# EAGLE design R4Nano (EAGLE 7.6.0)
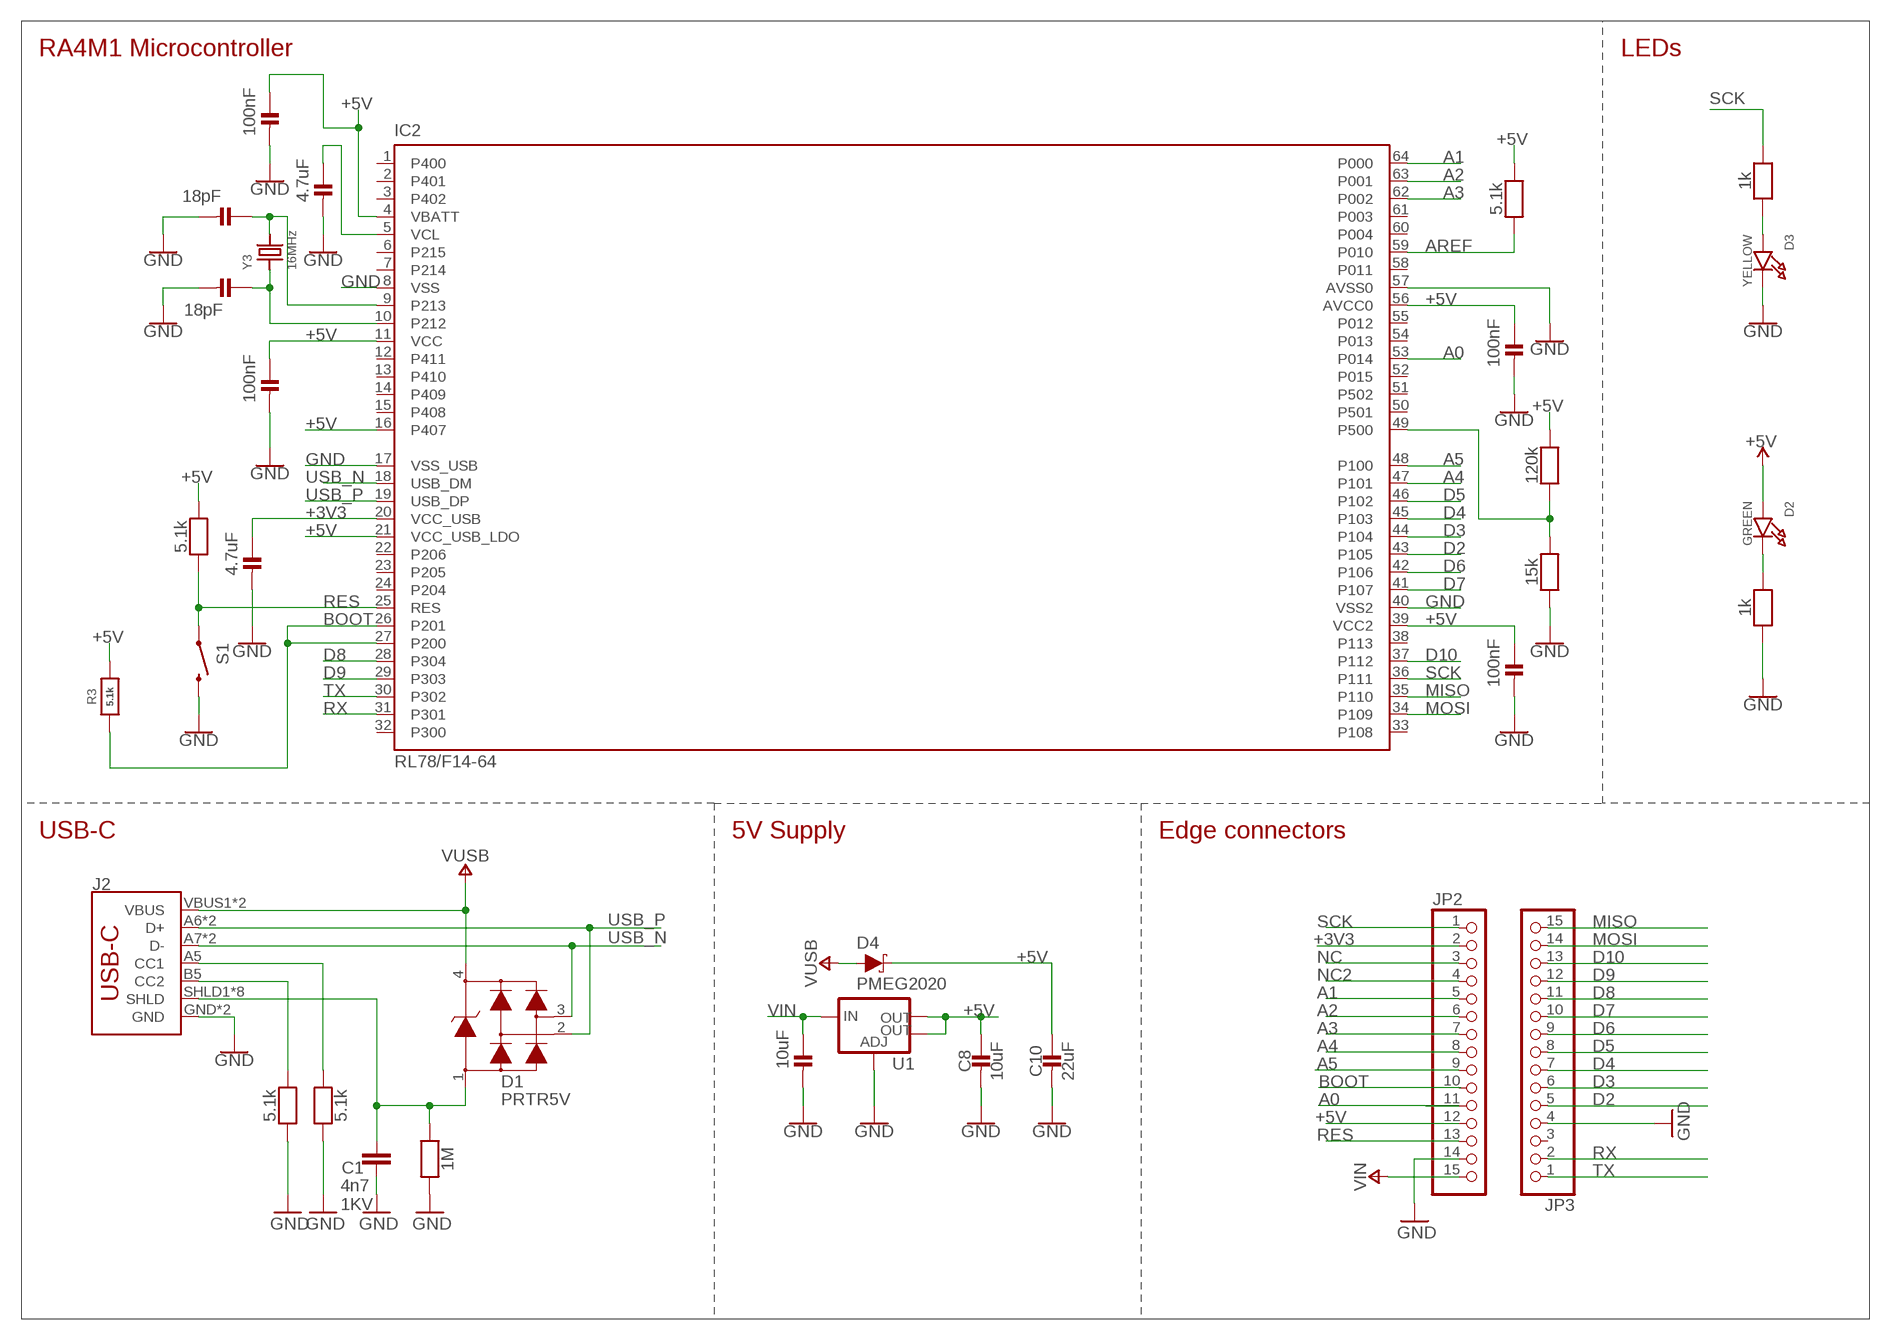
[diagram p0: schematic, sheet 1]

## Parts
C1  4n7  C4.7NF-0805  [0805-R2013X50N]
C2  4.7uF  CAP_CERAMIC_0805MP  [_0805MP]
C3  100nF  CAP_CERAMIC_0805MP  [_0805MP]
C4  100nF  CAP_CERAMIC_0805MP  [_0805MP]
C5  4.7uF  CAP_CERAMIC_0805MP  [_0805MP]
C6  100nF  CAP_CERAMIC_0805MP  [_0805MP]
C7  10uF  CAP_CERAMIC_0805MP  [_0805MP]
C8  10uF  CAP_CERAMIC_0805MP  [_0805MP]
C9  100nF  CAP_CERAMIC_0805MP  [_0805MP]
C10  22uF  CAP_CERAMIC_0805MP  [_0805MP]
C12  18pF  CAP_CERAMIC_0805MP  [_0805MP]
C13  18pF  CAP_CERAMIC_0805MP  [_0805MP]
D1  PRTR5V  PRTR5V0U2X,215  [SOT190P230X110-4N]
D2  GREEN  LED0805_NOOUTLINE  [CHIPLED_0805_NOOUTLINE]
D3  YELLOW  LED0805_NOOUTLINE  [CHIPLED_0805_NOOUTLINE]
D4  PMEG2020  DIODE-SCHOTTKY-BAT60A  [SOD-323]
IC2  RL78/F14-64  [P-LFQFP64-10X10]
J2  USB_C2-LAYER  [USB-C-16P]
JP2  HEADER-1X15  [1X15_ROUND_70]
JP3  HEADER-1X15  [1X15_ROUND_70]
R1  1M  RESISTOR_0805MP  [_0805MP]
R2  5.1k  RESISTOR_0805MP  [_0805MP]
R3  5.1k  RESISTOR_0805MP  [_0805MP]
R4  5.1k  RESISTOR_0805MP  [_0805MP]
R5  1k  RESISTOR_0805MP  [_0805MP]
R6  5.1k  RESISTOR_0805MP  [_0805MP]
R8  5.1k  RESISTOR_0805MP  [_0805MP]
R10  120k  RESISTOR_0805MP  [_0805MP]
R11  15k  RESISTOR_0805MP  [_0805MP]
R12  1k  RESISTOR_0805MP  [_0805MP]
S1  SWITCH-MOMENTARY-2SMD-4.6X2.8MM  [TACTILE_SWITCH_SMD_4.6X2.8MM]
U1  V_REG_LM1117SOT223  [SOT223]
Y3  16MHz  CRYSTAL2.5X2.0MM  [CRYSTAL_2.5X2]

## Nets
+3V3: C5.1 IC2.20(VCC_USB) JP2.2
+5V: C3.1 C4.1 C6.1 C8.1 C9.1 C10.1 D2.A D4.C IC2.4(VBATT) IC2.11(VCC) IC2.16(P407) IC2.21(VCC_USB_LDO) IC2.39(VCC2) IC2.56(AVCC0) JP2.12 R2.1 R3.1 R4.1 R10.1 U1.2(OUT) U1.4(OUT) ; supply symbol labelled VOUT
A0: IC2.53(P014) JP2.11
A1: IC2.64(P000) JP2.5
A2: IC2.63(P001) JP2.6
A3: IC2.62(P002) JP2.7
A4: IC2.47(P101) JP2.8
A5: IC2.48(P100) JP2.9
AREF: IC2.59(P010) R2.2
BOOT: IC2.26(P201) IC2.27(P200) JP2.10 R3.2
CC1: J2.A5(CC1) R8.1
CC2: J2.B5(CC2) R6.1
D2: IC2.43(P105) JP3.5
D3: IC2.44(P104) JP3.6
D4: IC2.45(P103) JP3.7
D5: IC2.46(P102) JP3.8
D6: IC2.42(P106) JP3.9
D7: IC2.41(P107) JP3.10
D8: IC2.28(P304) JP3.11
D9: IC2.29(P303) JP3.12
D10: IC2.37(P112) JP3.13
GND: C1.2 C2.2 C3.2 C4.2 C5.2 C6.2 C7.2 C8.2 C9.2 C10.2 C12.2 C13.2 D3.C IC2.8(VSS) IC2.17(VSS_USB) IC2.40(VSS2) IC2.57(AVSS0) J2.GND J2.GND2(GND) JP2.14 JP3.4 R1.2 R5.1 R6.2 R8.2 R11.2 S1.3 S1.4 U1.1(ADJ)
MISO: IC2.35(P110) JP3.15
MOSI: IC2.34(P109) JP3.14
N$1: C12.1 IC2.9(P213) Y3.3
N$2: C13.1 IC2.10(P212) Y3.1
N$3: C2.1 IC2.5(VCL)
N$4: D2.C R5.2
N$5: D3.A R12.2
N$9: IC2.49(P500) R10.2 R11.1
NC: JP2.3
NC2: JP2.4
RES: IC2.25(RES) JP2.13 R4.2 S1.1 S1.2
RX: IC2.31(P301) JP3.2
SCK: IC2.36(P111) JP2.1 R12.1
SHIELD: C1.1 D1.1 J2.SHLD1(SHLD) J2.SHLD2(SHLD) J2.SHLD3(SHLD) J2.SHLD4(SHLD) J2.SHLD5(SHLD) J2.SHLD6(SHLD) J2.SHLD7(SHLD) J2.SHLD8(SHLD) R1.1
TX: IC2.30(P302) JP3.1
USB_N [usb]: D1.3 IC2.18(USB_DM) J2.A7(D-) J2.B7(D-)
USB_P [usb]: D1.2 IC2.19(USB_DP) J2.A6(D+) J2.B6(D+)
VIN: C7.1 JP2.15 U1.3(IN)
VUSB: D1.4 D4.A J2.VBUS1(VBUS) J2.VBUS2(VBUS)
Unconnected: IC2.1(P400) IC2.2(P401) IC2.3(P402) IC2.6(P215) IC2.7(P214) IC2.12(P411) IC2.13(P410) IC2.14(P409) IC2.15(P408) IC2.22(P206) IC2.23(P205) IC2.24(P204) IC2.32(P300) IC2.33(P108) IC2.38(P113) IC2.50(P501) IC2.51(P502) IC2.52(P015) IC2.54(P013) IC2.55(P012) IC2.58(P011) IC2.60(P004) IC2.61(P003) JP3.3

## Notes on the sheet
- RA4M1 Microcontroller | LEDs
- USB-C | 5V Supply | Edge connectors

## Library data of the parts
C1 = Arduino-rcl:C: SMD Capacitor; CODE-ARDUINO: 0689; DATASHEET: http://www.kemet.com/Lists/ProductCatalog/Attachments/40/KEM_C1010_X7R_HV_SMD.pdf; DISTRIBUTOR-LINK: www.kemet.com/docfinder?Partnumber=C0805C472KDRACTU; DISTRIBUTOR-PN: 399-6738-1-ND; MANUFACTURER: Kemet; MANUFACTURER-PN: C0805C472KDRACTU; NOTE: -; VOLTAGE: 1KV
C2-C10 C12 C13 = microbuilder:CAP_CERAMIC: Ceramic Capacitors For new designs, use the packages preceded by an '_' character since they are more reliable: The following footprints should be used on most boards: _0402 - Standard footprint for regular board layouts _0603 - Standard footprint for regular board layouts _0805 - Standard footprint for regular board layouts _1206 - Standard footprint for regular board layouts For extremely tight-pitch boards where space is at a premium, the following 'micro-pitch' footprints can be used (smaller pads, no silkscreen outline, etc.): _0402MP - Micro-pitch footprint for very dense/compact boards _0603MP - Micro-pitch footprint for very dense/compact boards _0805MP - Micro-pitch footprint for very dense/compact boards _1206MP - Micro-pitch footprint for very dense/compact boards
D1 = Arduino-diodes:PRTR5V0U2X,215: USB ESD protection; CODE-ARDUINO: 2209; DATASHEET: http://www.nxp.com/documents/data_sheet/PRTR5V0U2X.pdf; DISTRIBUTOR-LINK: http://www.digikey.com/product-detail/en/nxp-semiconductors/PRTR5V0U2X,215/568-4140-1-ND/1589981; DISTRIBUTOR-PN: 568-4140-1-ND; MANUFACTURER: NXP; MANUFACTURER-PN: PRTR5V0U2X,215
D2 D3 = microbuilder:LED: LED 0603 - 0603 Surface Mount Package 2mA: Green LED - Low Power (3.9mcd, 2ma, 1.7Vf) - Digikey: 475-2709-2-ND Orange LED - Low Power (9.8mcd, 2ma, 1.8Vf) - Digikey: 475-1194-2-ND Red LED - Low Power (5mcd, 2ma, 1.8Vf) - Digikey: 475-1195-2-ND Yellow LED - Low Power (7mcd, 2ma, 1.8Vf) - Digikey: 475-1196-2-ND 5mA: Blue LED - Low Power (17mcd, 5ma, 2.9Vf) - Digikey: LNJ937W8CRACT-ND 0805 - 0805 Surface Mount Package 2mA: Red LED (8.8mcd, 2mA, 1.8Vf, Clear) - Low Power [Digikey: 475-2510-1-ND] Green LED (5mcd, 2mA, 1.8Vf, Clear) - Low Power [Digikey: 475-2730-1-ND] Yellow LED (11.3mcd, 2mA, 1.8Vf, Clear) - Low Power [Digikey: 475-2555-1-ND] 20mA: Red LED (104mcd, 20mA, Diffused) - LS R976 [Digikey: 475-1278-6-ND] Red LED (12mcd, 20mA, 2.0Vf, Clear) - APT2012EC [Digikey: 754-1128-1-ND] Green LED (15mcd, 20mA, 2.2Vf, Clear) - APT2012GC [Digikey: 754-1131-1-ND] Orange LED (160mcd, 20mA, 2.1Vf, Clear) - APT2012SECK [Digikey: 754-1130-1-ND] 1206 - 1206 Surface Mount Package Green LED (26mcd, 20mA, Diffused) - LG N971 [Digikey: 475-1407-6-ND] Red LED (15mcd, 20mA, Diffused) - LH N974 [Digikey: 475-1416-6-ND]
D4 = SparkFun-DiscreteSemi:DIODE-SCHOTTKY: Schottky diode A Schottky diode is a semiconductor diode which has a low forward voltage drop and a very fast switching action.; PROD_ID: DIO-14072; VALUE: 3A/10V/280mV
IC2 = technoblogy:RL78/F14-64: 16-Bit Single-Chip Microcontroller Source: Data sheet <http://documentation.renesas.com/doc/products/mpumcu/doc/rl78/r01uh0368ej0200_rl78f13_14.pdf>
J2 = SparkFun-Connectors:USB_C: USB Type C 16Pin Connector Super Speed pins not available on the 16-pin purely SMD connector so this part is best for USB 2.0 implementations. D1 and D2 are tied together enabling D+/- no matter which way the cable is plugged into the connector. The two channel configuration pins (CC1/2) are exposed. These are normally connected to ground via 5.1k resistors but can be reconfigured for high current/high power applications.; PROD_ID: CONN-14122
JP2 JP3 = microbuilder:HEADER-1X15: 1x15 Header
R1-R6 R8 R10-R12 = microbuilder:RESISTOR: Resistors For new designs, use the packages preceded by an '_' character since they are more reliable: The following footprints should be used on most boards: _0402 - Standard footprint for regular board layouts _0603 - Standard footprint for regular board layouts _0805 - Standard footprint for regular board layouts _1206 - Standard footprint for regular board layouts For extremely tight-pitch boards where space is at a premium, the following 'micro-pitch' footprints can be used (smaller pads, no silkscreen outline, etc.): _0402MP - Micro-pitch footprint for very dense/compact boards _0603MP - Micro-pitch footprint for very dense/compact boards _0805MP - Micro-pitch footprint for very dense/compact boards _1206MP - Micro-pitch footprint for very dense/compact boards
S1 = SparkFun-Electromechanical:SWITCH-MOMENTARY-2: Various NO switches- pushbuttons, reed, etc; PROD_ID: SWCH-13065
U1 = SparkFun-PowerIC:V_REG_LM1117: Voltage Regulator LM1117 Standard adjustable voltage regulator but in SMD form. Spark Fun Electronics SKU : COM-00595; PROD_ID: VREG-08170
Y3 = microbuilder:CRYSTAL: Crystals HC49UP - Surface Mount Crystal 4.0MHz 18pF +/-30ppm Surface Mount Crystal [Digikey: 535-9857-1-ND] 12.0 MHz Surface Mount Crystal [Digikey: 535-9869-6-ND] 25.0 MHz Surface Mount Crystal [Digikey: 535-9078-1-ND] 2.5 x 2.0mm - MEMs SMT Crystal 16.0 MHz 10pF 20ppm 2.5 x 2.0mm Crystal [Digikey -40-85°C: 535-10923-1-ND] 3.2 x 2.5mm - MEMs SMT Crystal 12.0 MHz 8pF 15ppm 3.2 x 2.5mm Crystal [Digikey: -10-70°C: 644-1047-1-ND -40-125°C: 644-1128-1-ND] 16.0 MHz 8pF 15ppm 3.2 x 2.5mm Crystal [Digikey: -10-70°C: 644-1049-1-ND -40-125°C: 644-1129-2-ND] 16.0 MHz 10pF 10ppm 3.2 x 2.5mm Crystal [Digikey: 644-1100-1-ND] 27.12 MHz 18pF 30ppm 3.2 x 2.5mm Crystal [Digikey: 887-1424-1-ND] 27.12MHz 10pF 10ppm 3.2 x 2.5mm Crystal [Digikey: 887-1329-1-ND] 4.9 x 1.8mm - MEMs SMT Crystal 32.768 KHz 12.5pF 20ppm 4.9 x 1.8mm Crystal [Digikey: SE2415CT-ND] 8.0 x 3.8mm - Surface Mount Crystal 32.768kHz 12.5pF 20ppm -40°C-85°C [Digikey: 535-9166-2-ND] Cylinder 32.768KHz Cylinder Crystal (2x6mm body) [Ex. Digikey: 300-8341-2-ND]

## Net classes
0 default: width 0.152 mm, drill 0.305 mm, clearance 0.152 mm
1 usb: width 0.19 mm, drill 0.19 mm

## Board
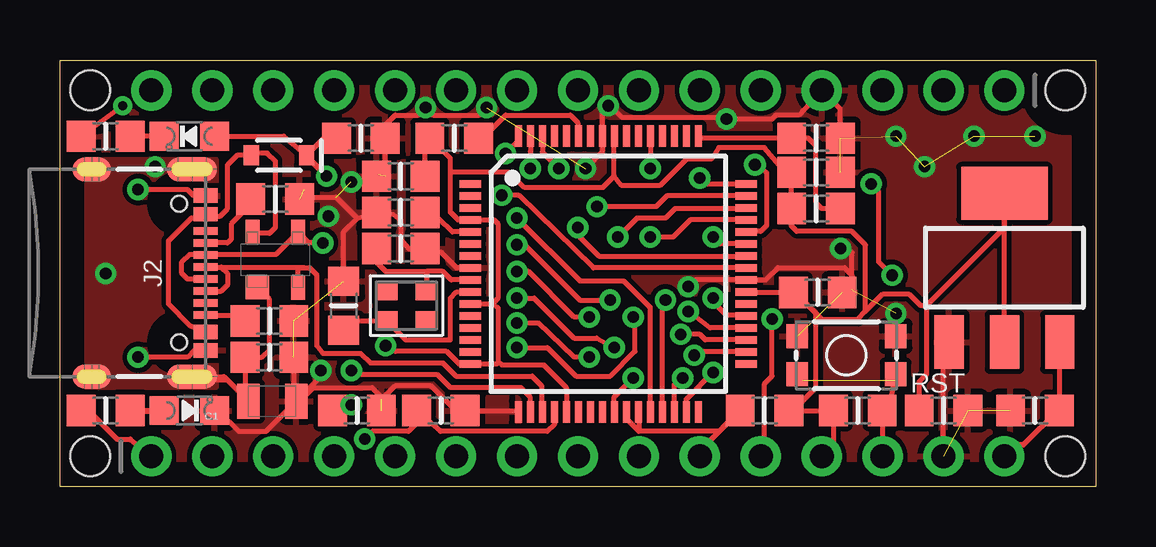
[diagram p1: board, top side]
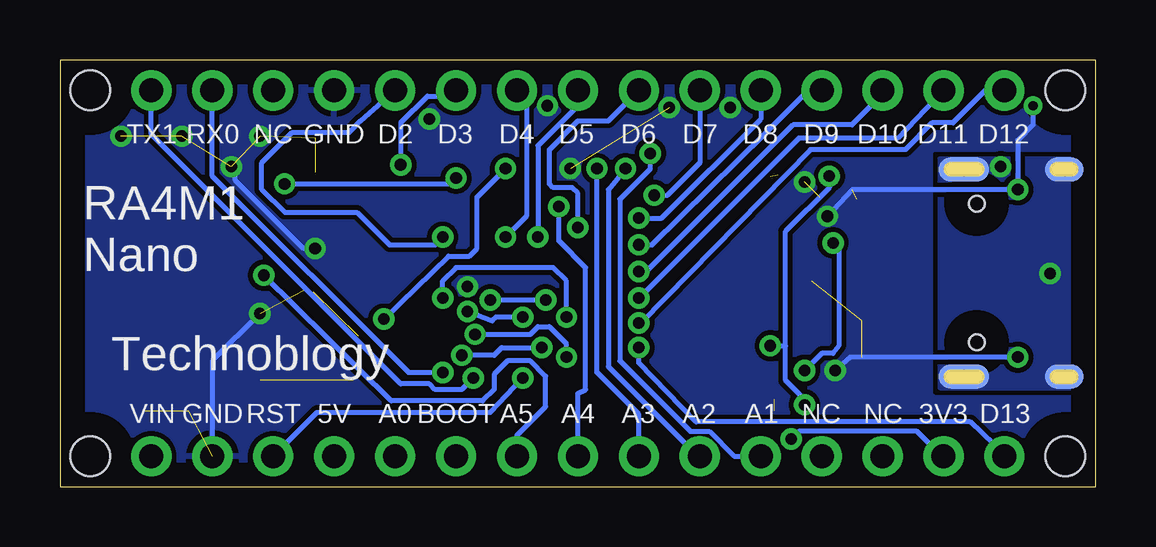
[diagram p2: board, bottom side, seen from below]

Size 43.18 x 17.78 mm. Coordinates in mm from the lower left corner, seen from the top.
Outline: 0,0 0,17.78 43.18,17.78 43.18,0 0,0
Copper layers (1*16): Top 0.035mm / dielectric 1.5mm / Bottom 0.035mm
Design rules "SeeedStudio_4layers *": minimum track width 8mil, minimum drill 19mil, track to track 8mil, track to pad 8mil, pad to pad 8mil, via to via 8mil, smd to smd 0mil, copper to edge 40mil, drill to drill 8mil, minimum pad ring 6mil, minimum via ring 8mil, stop-mask expansion 4mil, vias tented up to drill 20mil, thermal gap 10mil
Holes 1.65 mm at 1.27,16.51 1.27,1.27 41.91,1.27 41.91,16.51

### Footprints (pad centres in the part's own frame; a part is rotated, then mirrored left to right if it is on the bottom)
0805-R2013X50N = smd 0.95 x 1.45: 1 -1,0; 2 1,0
_0805MP = smd 1.2 x 1.3: 1 -1.016,0; 2 1.016,0
SOT190P230X110-4N = smd 1 x 1: 1 -1.15,0.75 | smd 1 x 0.6: 2 -1.15,-0.95; 3 1.15,-0.95; 4 1.15,0.95
CHIPLED_0805_NOOUTLINE = smd 1.2 x 1.2: A 0,-1.05; C 0,1.05
SOD-323 = smd 0.63 x 0.83: A 1.15,0; C -1.15,0
P-LFQFP64-10X10 = smd 0.9 x 0.3: 1 -5.75,3.75; 2 -5.75,3.25; 3 -5.75,2.75; 4 -5.75,2.25; 5 -5.75,1.75; 6 -5.75,1.25; 7 -5.75,0.75; 8 -5.75,0.25; 9 -5.75,-0.25; 10 -5.75,-0.75; 11 -5.75,-1.25; 12 -5.75,-1.75; 13 -5.75,-2.25; 14 -5.75,-2.75; 15 -5.75,-3.25; 16 -5.75,-3.75; 33 5.75,-3.75; 34 5.75,-3.25; 35 5.75,-2.75; 36 5.75,-2.25; 37 5.75,-1.75; 38 5.75,-1.25; 39 5.75,-0.75; 40 5.75,-0.25; 41 5.75,0.25; 42 5.75,0.75; 43 5.75,1.25; 44 5.75,1.75; 45 5.75,2.25; 46 5.75,2.75; 47 5.75,3.25; 48 5.75,3.75 | smd 0.3 x 0.9: 17 -3.75,-5.75; 18 -3.25,-5.75; 19 -2.75,-5.75; 20 -2.25,-5.75; 21 -1.75,-5.75; 22 -1.25,-5.75; 23 -0.75,-5.75; 24 -0.25,-5.75; 25 0.25,-5.75; 26 0.75,-5.75; 27 1.25,-5.75; 28 1.75,-5.75; 29 2.25,-5.75; 30 2.75,-5.75; 31 3.25,-5.75; 32 3.75,-5.75; 49 3.75,5.75; 50 3.25,5.75; 51 2.75,5.75; 52 2.25,5.75; 53 1.75,5.75; 54 1.25,5.75; 55 0.75,5.75; 56 0.25,5.75; 57 -0.25,5.75; 58 -0.75,5.75; 59 -1.25,5.75; 60 -1.75,5.75; 61 -2.25,5.75; 62 -2.75,5.75; 63 -3.25,5.75; 64 -3.75,5.75
USB-C-16P = smd 0.3 x 1: A5 -1.25,-0.34; A6 -0.25,-0.34; A7 0.25,-0.34; A8 1.25,-0.34; B5 1.75,-0.34; B6 0.75,-0.34; B7 -0.75,-0.34; B8 -1.75,-0.34 | smd 0.6 x 1: GND -3.225,-0.34; GND2 3.225,-0.34; VBUS1 -2.45,-0.34; VBUS2 2.45,-0.34 | smd 1 x 2.1: SHLD1 -4.32,-0.915; SHLD2 4.32,-0.915 | smd 1 x 2.1 bottom: SHLD3 -4.32,-0.915; SHLD4 4.32,-0.915 | smd 1 x 1.6: SHLD5 -4.32,-5.095; SHLD8 4.32,-5.095 | smd 1 x 1.6 bottom: SHLD6 -4.32,-5.095; SHLD7 4.32,-5.095 | hole 0.65: -2.89,-1.445; 2.89,-1.445
1X15_ROUND_70 = drill 1 pad 1.676: 1 -17.78,0; 2 -15.24,0; 3 -12.7,0; 4 -10.16,0; 5 -7.62,0; 6 -5.08,0; 7 -2.54,0; 8 0,0; 9 2.54,0; 10 5.08,0; 11 7.62,0; 12 10.16,0; 13 12.7,0; 14 15.24,0; 15 17.78,0
TACTILE_SWITCH_SMD_4.6X2.8MM = smd 0.9 x 1: 1 -2.05,-0.8; 2 2.05,-0.8; 3 2.05,0.8; 4 -2.05,0.8
SOT223 = smd 1.219 x 2.235: 1 -2.311,-3.099; 2 0,-3.099; 3 2.311,-3.099 | smd 3.6 x 2.2: 4 0,3.099
CRYSTAL_2.5X2 = smd 0.9 x 0.8: 1 -0.825,-0.625; 2 0.825,-0.625; 3 0.825,0.625; 4 -0.825,0.625

### Placement (x,y rotation side)
C1  8.85,3.57 0 top
C2  14.21,11.43 180 top
C3  12.38,3.17 0 top
C4  14.21,12.94 180 top
C5  15.88,3.17 0 top
C6  31.59,8.1 0 top
C7  40.64,3.17 180 top
C8  36.83,3.17 0 top
C9  31.51,13.1 0 top
C10  12.54,14.53 0 top
C12  14.21,9.92 0 top
C13  11.83,7.54 90 top
D1  8.98,9.46 90 top
D2  5.4,14.61 90 top
D3  5.4,3.17 270 top
D4  9.13,13.81 180 top
IC2  22.86,8.87 0 top
J2  6.42,8.9 270 top
JP2  21.59,1.27 0 top
JP3  21.59,16.51 180 top
R1  8.73,5.4 0 top
R2  16.43,14.53 0 top
R3  29.37,3.17 180 top
R4  33.26,3.17 0 top
R5  1.91,14.61 0 top
R6  8.73,6.91 0 top
R8  8.97,11.99 0 top
R10  31.51,11.59 0 top
R11  31.51,14.53 0 top
R12  1.91,3.17 0 top
S1  32.78,5.48 0 top
U1  39.37,9.13 0 top
Y3  14.45,7.54 0 top

### Tracks (layer width: path | path; a pad name or v marks a point on that pad's centre or on a via)
+3V3  (via drill 0.48)
  Top 0.203: IC2.20 20.61,2.59 20.32,2.3 15.86,2.3 C5.1 14.92,3.16 14.92,2.7 14.53,2.3 13.02,2.3 v12.7,1.98
  Bottom 0.203: JP2.2 6.43,1.27 7.46,2.3 12.38,2.3 v12.7,1.98
+5V  (via drill 0.48)
  Top 0.203: 36.12,7.54 39.37,10.79 U1.4 U1.2 | 36.12,7.54 36.12,4.68 35.81,4.38 C8.1 | IC2.39 28.61,8.1 C6.1 | D2.A 9.33,14.61 9.44,14.51 D4.C 10.99,14.53 C10.1 | JP2.12 32.24,1.76 R4.1 R3.1 30.56,3.17 31.51,4.13 31.51,7.24 C6.1 | IC2.11 18.02,7.62 | 18.02,7.62 18.26,7.46 18.26,5.16 | 18.02,7.62 18.26,7.85 18.26,10.95 18.09,11.12 IC2.4 16.59,11.12 16.27,11.43 16.27,13.1 | C6.1 30.64,8.1 31.75,6.99 33.26,6.99 33.58,7.3 | 33.58,7.3 33.58,10.08 33.02,10.64 30.72,10.64 30.48,10.87 30.48,11.57 R10.1 C9.1 30.24,13.1 29.37,14.13 27.46,14.13 27.15,13.65 26.11,13.65 25,12.54 23.42,12.54 23.1,12.94 | 36.12,7.54 35.88,7.54 35.4,8.02 34.29,8.02 33.58,7.3 | 23.1,12.94 22.62,12.46 19.37,12.46 18.73,13.1 16.27,13.1 | IC2.21 21.11,4.13 20.16,5.08 18.41,5.08 18.34,5.16 18.26,5.16 | 16.27,13.1 16.27,13.67 R2.1 15.22,14.34 C4.1 | 23.1,12.94 23.1,14.61 IC2.56 | C3.1 v12.14,3.41 | v13.57,5.87 13.97,5.64 16.11,5.64 16.63,5.12 IC2.16 18.21,5.12 18.26,5.16
  Top 0.254: D4.C 10.28,13.77 v11.11,12.94
  Bottom 0.203: 12.94,5.87 12.94,4.45 12.14,3.65 v12.14,3.41 | 12.94,5.87 12.94,10.64 11.11,12.46 v11.11,12.94 | v13.57,5.87 12.94,5.87
A0  (via drill 0.48)
  Top 0.203: IC2.53 v24.61,13.26 | JP2.11 29.37,1.27 29.37,4.29 29.69,4.6 v29.69,6.99
  Bottom 0.203: v29.69,6.99 26.99,9.6 26.11,9.6 25.8,9.92 25.8,12.06 v24.61,13.26
A1  (via drill 0.48)
  Top 0.203: IC2.64 19.11,14.43 v18.57,13.89
  Bottom 0.203: v18.57,13.89 18.57,13.26 19.84,11.99 19.84,5.24 16.91,2.3 16.11,2.3 15.08,1.27 JP2.5
A2  (via drill 0.48)
  Top 0.203: IC2.63 19.61,13.97 v19.61,13.26
  Bottom 0.203: v19.61,13.26 20.32,12.38 20.32,5 17.14,1.83 JP2.6
A3  (via drill 0.48)
  Top 0.203: IC2.62 20.11,13.94 v20.8,13.26
  Bottom 0.203: JP2.7 19.05,3.02 20.8,4.76 v20.8,13.26
A4  (via drill 0.48)
  Top 0.203: 22.46,11.67 v22.38,11.67 24.84,11.67 25.29,12.12 IC2.47
  Bottom 0.203: JP2.8 21.59,3.89 21.27,4.05 21.27,9.13 22.38,10.24 v22.38,11.67
A5  (via drill 0.48)
  Top 0.203: v26.67,12.86 26.91,12.62 IC2.48 | v34.69,8.81 34.13,9.37 34.13,12.3 v33.81,12.62
  Bottom 0.203: JP2.9 24.13,2.14 22.94,3.33 22.94,4.6 23.57,5.24 24.53,5.24 25.08,4.68 25.08,4.05 25.56,3.57 29.37,3.57 v34.69,8.81 | v33.81,12.62 26.91,12.62 v26.67,12.86
AREF
  Top 0.203: 17.46,14.61 R2.2 17.62,14.53 18.57,15.48 21.27,15.48 21.59,15.16 21.59,14.63 IC2.59
BOOT
  Top 0.203: 24.13,2.3 27.46,2.3 28.26,3.17 R3.2 26.67,1.49 JP2.10 | IC2.27 24.13,3.12 24.13,2.3 | IC2.26 23.61,2.82 24.13,2.3
CC1
  Top 0.203: R8.1 8.03,11.84 7.14,10.95 7.14,10.32 6.99,10.16 J2.A5
CC2
  Top 0.203: J2.B5 7.87,7.16 R6.1
D2  (via drill 0.48)
  Top 0.203: IC2.43 27.51,10.12 v27.23,10.4
  Bottom 0.203: v27.23,10.4 27.54,10.08 29.45,10.08 30.8,11.43 33.81,11.43 34.77,12.38 34.77,13.49 33.5,14.76 31.11,14.76 30.64,15.24 JP3.5
D3  (via drill 0.5)
  Top 0.203: IC2.44 28.47,10.64 29.21,10.64 29.45,10.87 29.45,13.1 v28.97,13.41
  Bottom 0.203: v28.97,13.41 28.97,15.16 27.86,16.27 26.91,16.27 JP3.6
D4  (via drill 0.48)
  Top 0.203: IC2.45 26.28,11.12 25.56,10.4 v24.61,10.4
  Bottom 0.203: JP3.7 23.73,16.11 23.73,11.27 v24.61,10.4
D5  (via drill 0.48)
  Top 0.203: IC2.46 28.58,11.59 25.64,11.59 25.24,11.19 24.05,11.19 v23.26,10.4
  Bottom 0.203: v23.26,10.4 23.26,14.21 21.59,15.88 JP3.8
D6  (via drill 0.48)
  Top 0.203: IC2.42 28.6,9.6 22.46,9.6 21.59,10.48 v21.59,10.79
  Bottom 0.203: v21.59,10.79 21.59,12.22 21.83,12.46 22.62,12.46 22.78,12.62 22.78,14.05 21.59,15.24 20.32,15.24 JP3.9
D7  (via drill 0.48)
  Top 0.203: IC2.41 22.24,9.12 19.13,12.14 v18.41,12.14
  Bottom 0.203: v18.41,12.14 17.86,12.14 16.51,13.49 JP3.10
D8  (via drill 0.48)
  Top 0.203: v19.05,11.19 21.67,8.57 23.5,8.57 24.61,7.46 IC2.28
  Bottom 0.203: v19.05,11.19 18.1,11.19 13.97,15.32 JP3.11
D9  (via drill 0.48)
  Top 0.203: IC2.29 25.11,7.36 v25.24,7.78 | v22.93,7.78 21.67,7.78 19.37,10.08 v19.05,10.08
  Bottom 0.203: v19.05,10.08 18.49,10.08 13.73,14.76 11.99,16.51 JP3.12 | v22.93,7.78 v25.24,7.78
D10  (via drill 0.48)
  Top 0.203: IC2.37 28.58,7.14 27.78,7.14 27.23,7.7 v27.23,7.86 | v22.07,7.06 21.43,7.06 19.53,8.97 v19.05,8.97
  Bottom 0.203: v22.07,7.06 22.07,8.57 22.62,9.13 26.67,9.13 27.23,8.57 v27.23,7.86 | JP3.13 8.89,16.35 10.16,15.08 12.62,15.08 18.73,8.97 v19.05,8.97
GND  (via drill 0.38, 0.48)  (16 unrouted)
  Top 0.203: JP2.14 36.83,5.56 U1.1 | 17.1,9.13 IC2.8 16.52,9.12 15.88,9.76 15.3,9.76 C12.2 14.53,9.92 14.21,10.32 14.21,11.11 13.89,11.35 C2.2 12.38,11.19 | v21.91,13.26 22.61,13.98 IC2.57 22.62,14.63 22.62,15.64 v22.86,15.88 22.94,15.88 23.42,15.4 27.7,15.4 v27.78,15.32 29.69,15.32 29.84,15.48 30.8,15.48 JP3.4 32.53,15.73 R11.2 | 33.02,8.81 32.7,9.13 29.92,9.13 29.41,8.62 IC2.40 26.48,8.62 v26.19,8.33 | 33.02,8.81 33.02,8.19 C6.2 | J2.GND 5.57,12.13 5.32,12.38 v3.25,12.38 | v34.85,7.22 34.83,7.13 S1.3 34.85,6.28 34.92,6.35 | 1.21,14.92 R5.1 | R5.1 1.27,14.61 | v2.62,15.88 R5.1 | 33.02,8.81 33.02,9.76 v32.54,9.92 | C13.2 11.83,10.64 12.38,11.19 | C1.2 9.92,3.57 9.92,3.81 10.23,3.81 10.56,4.13 13.02,4.13 13.45,3.69 | R8.2 10.49,12.06 11.51,12.06 12.38,11.19 | R1.2 9.75,3.67 C1.2 | v17.78,15.8 17.46,15.48 15.56,15.48 v15.24,15.8 14.92,15.48 13.97,15.48 13.57,15.08 13.57,14.54 C10.2 13.56,13.3 C4.2 | v12.14,12.7 12.88,12.7 C4.2 | IC2.17 19.05,3.17 C5.2 16.51,3.17 15.48,4.21 13.97,4.21 13.45,3.69 | 13.4,3.63 13.45,3.69 | J2.GND2 5.6,5.68 5.32,5.4 v3.25,5.4 | v10.87,4.84 10.87,4.59 C1.2 | 13.26,13 C4.2 | 13.57,12.94 13.18,12.54 | D3.C 6.59,3.17 7.46,2.3 8.59,2.3 C1.2
  Bottom 0.203: v11.19,11.27 10.16,12.38 v3.25,12.38 3.25,14.45 2.62,15.08 v2.62,15.88 | v32.54,9.92 33.02,9.92 35.88,12.78 35.88,13.18 v36.04,13.34 | v3.25,5.4 10.24,5.4 v10.87,4.84 | v34.85,7.22 36.83,5.24 JP2.14
  other vias: 38.1,14.61 34.85,14.61 40.64,14.61
  pour Bottom (isolate 0.203, rank 2): -0.08,17.76 43.1,17.76 43.18,3.8 43.18,0 0,0
  pour Top (rank 2): -0.08,17.76 43.07,17.76 43.1,17.79 43.18,3.8 43.18,0 0,0
MISO  (via drill 0.48)
  Top 0.203: IC2.35 26.9,6.12 26.67,6.35 v25.88,6.35 | v19.05,6.83 19.92,6.83 21.43,5.4 v22.07,5.4
  Bottom 0.203: v19.05,6.83 18.97,6.83 11.91,14.05 7.94,14.05 6.83,15.16 5.95,15.16 4.6,16.51 JP3.15 | v22.07,5.4 22.07,5.95 22.78,6.67 23.26,6.67 23.57,6.35 v25.88,6.35
MOSI  (via drill 0.48)
  Top 0.203: IC2.34 26.65,5.62 v26.43,5.48 | v23.1,5.79 22.38,6.19 21.43,6.19 19.76,7.86 v19.05,7.86
  Bottom 0.203: JP3.14 8.26,14.53 12.38,14.53 v19.05,7.86 | v23.1,5.79 24.77,5.79 25.08,5.48 v26.43,5.48
N$1
  Top 0.203: IC2.9 16.31,8.62 15.95,8.97 15.27,8.97 | C12.1 13.19,9.34 13.57,8.97 15.27,8.97 | 15.27,8.97 Y3.3
N$2
  Top 0.203: C13.1 11.88,6.92 Y3.1 14.43,6.11 16.27,6.11 16.27,7.86 16.51,8.1 17.09,8.1 IC2.10
N$3
  Top 0.203: IC2.5 16.36,10.62 15.78,11.19 15.54,11.19 C2.1
N$4
  Top 0.203: D2.C R5.2
N$5
  Top 0.254: R12.2 D3.A
N$9
  Top 0.203: R10.2 31.75,11.59 31.51,11.83 31.51,14.21 31.19,14.53 R11.1 26.7,14.53 IC2.49
RES  (via drill 0.48)  (1 unrouted)
  Top 0.203: 34.38,1.36 JP2.13 34.27,1.29 R4.2 34.59,3.5 S1.2 34.83,4.99 34.92,5.08 34.92,4.45 | IC2.25 23.1,3.13 23.1,3.73 v23.89,4.52 | 30.96,4.45 S1.1
  Top 0.406: 34.83,4.45 S1.2
  Bottom 0.203: JP2.13 32.46,3.1 25.24,3.1 v23.89,4.52
RX  (via drill 0.48)
  Top 0.203: IC2.31 26.11,3.65 v27.23,4.76
  Bottom 0.203: v27.23,4.76 28.65,4.76 36.83,12.94 JP3.2
SCK  (via drill 0.48)
  Top 0.203: R12.1 1.11,3.25 2.38,1.98 2.94,1.98 JP2.1 | IC2.36 27.09,6.62 v26.19,7.3 | v19.05,5.79 20.32,5.79 21.51,4.6 22.94,4.6 23.97,5.64 23.97,6.75 v23.89,7.06
  Bottom 0.203: JP2.1 3.73,1.27 5.24,2.7 16.67,2.7 19.05,5.16 v19.05,5.79 | v26.19,7.3 25.16,6.91 25,7.06 v23.89,7.06
SHIELD  (via drill 0.48)
  Top 0.203: 8.38,8.19 D1.1 8.73,7.8 8.73,5.71 8.41,5.4 R1.1 7.71,3.7 C1.1 | 7.86,3.57 6.99,4.45 5.64,4.45 J2.SHLD4 6.83,4.58 C1.1 | C1.1 7.86,3.57 | 7.86,3.57 7.92,3.57
  other vias: 3.97,13.34 1.91,8.89
  pour Bottom (no thermals): 0.64,13.65 6.51,13.65 6.51,4.13 0.64,4.13
  pour Top (no thermals): 0.64,13.65 6.51,13.65 6.51,4.13 0.64,4.13
TX  (via drill 0.48)
  Top 0.203: IC2.30 25.61,4.26 v25.96,4.52
  Bottom 0.203: v25.96,4.52 26.43,4.05 27.54,4.05 27.78,4.29 28.97,4.29 39.37,14.68 JP3.1
USB_N  (via drill 0.48)
  Top 0.203: 10.1,10.45 10.16,10.39 9.83,10.39 9.83,10.52 D1.3 | J2.A7 5.32,8.65 5.08,8.89 5.08,9.37 5.4,9.68 6.05,9.68 J2.B7 6.1,9.68 9,9.68 D1.3 | IC2.18 19.61,3.73 19.21,4.13 16.27,4.13 15.72,4.68 12.3,4.68 v12.14,4.84 | v10.95,10.16 10.38,10.16 D1.3
  Bottom 0.203: v10.95,10.16 10.72,9.92 10.72,5.87 10.95,5.56 11.43,5.56 v12.14,4.84
USB_P
  Top 0.203: 10.16,9.13 6.1,9.13 J2.A6 6.72,9.15 6.99,8.89 6.99,8.41 6.73,8.15 J2.B6 | D1.2 9.93,9.13 10.16,9.13 | IC2.19 20.08,3.14 20.08,4.21 19.68,4.6 16.51,4.6 15.95,5.16 12.94,5.16 12.54,5.56 10.95,5.56 10.72,5.87 10.72,8.81 10.4,9.13 10.16,9.13
VIN
  Top 0.203: U1.3 41.67,5.56 41.67,3.75 C7.1 41.59,3.49 41.59,3.17 40.16,1.75 39.85,1.75 JP2.15
VUSB
  Top 0.203: 8.19,10.71 D1.4 8.21,10.56 8.73,10.56 8.97,10.79 8.97,13.57 8.64,13.9 7.91,13.9 D4.A 7.38,13.81 6.99,13.41 6.99,11.59 6.67,11.27 6.16,11.27 J2.VBUS1 5.48,11.19 4.52,10.24 4.52,7.62 5.45,6.69 J2.VBUS2

### Text on the board
tPlace: RST
bPlace: D12 | D11 | D10 | D9 | D8 | D7 | D6 | D5 | D4 | D3 | D2 | GND | NC | RX0 | TX1 | RA4M1 / Nano | Technoblogy | D13 | 3V3 | NC | NC | A1 | A2 | A3 | A4 | A5 | BOOT | A0 | 5V | RST | GND | VIN
test-probe: 5V | VIN(5V) | VCC | GND | RESET | 14 | 13 | 12 | 11 | 10 | 9 | 8 | 7 | 6 | USB_5V | USB_D- | SWCLK | SWDIO | JGND | JRST | VTG | BATT+ | BATT- | USB_D+ | USB_GND | AREF | A0 | A1 | A2 | A3 | A4 | A5 | A6 | 0 | 1 | 2 | 3 | 4 | 5